# EAGLE design arduino-breakout (EAGLE 5.02)
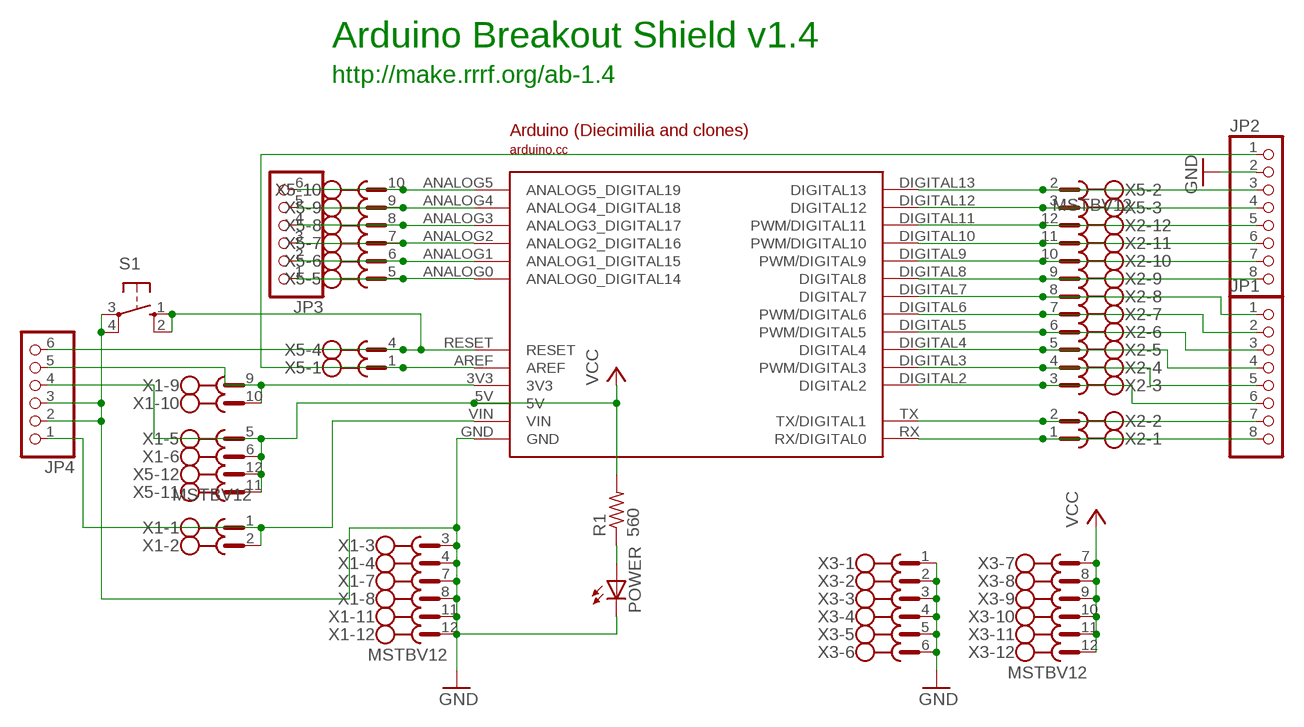
[diagram p0: schematic, sheet 1]

## Parts
JP1  PINHD-1X8  [1X08]
JP2  PINHD-1X8  [1X08]
JP3  PINHD-1X6  [1X06]
JP4  PINHD-1X6  [1X06]
POWER  LED5MM  [LED5MM]
R1  560  R-US_0207/7  [0207/7]
S1  10-XX  [B3F-10XX]
U$1  ARDUINODIECIMILIA  [ARDUINO]
X1  MSTBV12  [MSTBV12]
X2  MSTBV12  [MSTBV12]
X3  MSTBV12  [MSTBV12]
X5  MSTBV12  [MSTBV12]

## Nets
GND: JP2.2 JP4.2 JP4.3 POWER.K(C) S1.3(P) S1.4(P1) U$1.GND X1.3 X1.4 X1.7 X1.8 X1.11 X1.12 X3.1 X3.2 X3.3 X3.4 X3.5 X3.6
N$1: JP1.8 U$1.RX(RX/DIGITAL0) X2.1
N$2: JP1.7 U$1.TX(TX/DIGITAL1) X2.2
N$3: JP1.6 U$1.DIGITAL2 X2.3
N$4: JP1.5 U$1.DIGITAL3(PWM/DIGITAL3) X2.4
N$5: JP1.4 U$1.DIGITAL4 X2.5
N$6: JP1.3 U$1.DIGITAL5(PWM/DIGITAL5) X2.6
N$7: JP1.2 U$1.DIGITAL6(PWM/DIGITAL6) X2.7
N$8: JP1.1 U$1.DIGITAL7 X2.8
N$9: JP2.8 U$1.DIGITAL8 X2.9
N$10: JP2.7 U$1.DIGITAL9(PWM/DIGITAL9) X2.10
N$11: JP2.6 U$1.DIGITAL10(PWM/DIGITAL10) X2.11
N$12: JP2.5 U$1.DIGITAL11(PWM/DIGITAL11) X2.12
N$13: JP2.4 U$1.DIGITAL12 X5.3
N$14: JP2.3 U$1.DIGITAL13 X5.2
N$15: JP4.6 S1.1(S) S1.2(S1) U$1.RESET X5.4
N$16: POWER.A R1.1
N$17: JP3.6 U$1.ANALOG5(ANALOG5_DIGITAL19) X5.10
N$18: JP3.5 U$1.ANALOG4(ANALOG4_DIGITAL18) X5.9
N$19: JP3.4 U$1.ANALOG3(ANALOG3_DIGITAL17) X5.8
N$20: JP3.3 U$1.ANALOG2(ANALOG2_DIGITAL16) X5.7
N$21: JP3.2 U$1.ANALOG1(ANALOG1_DIGITAL15) X5.6
N$22: JP3.1 U$1.ANALOG0(ANALOG0_DIGITAL14) X5.5
N$23: JP2.1 U$1.AREF X5.1
N$26: JP4.5 U$1.3V3 X1.9 X1.10
N$28: JP4.1 U$1.VIN X1.1 X1.2
VCC: JP4.4 R1.2 U$1.5V X1.5 X1.6 X3.7 X3.8 X3.9 X3.10 X3.11 X3.12 X5.11 X5.12

## Notes on the sheet
- Arduino Breakout Shield v1.4
- http://make.rrrf.org/ab-1.4

## Library data of the parts
JP1 JP2 = pinhead:PINHD-1X8: PIN HEADER
JP3 JP4 = pinhead:PINHD-1X6: PIN HEADER
POWER = led:LED: LED OSRAM: - CHIPLED LG R971, LG N971, LY N971, LG Q971, LY Q971, LO R971, LY R971 LH N974, LH R974 LS Q976, LO Q976, LY Q976 LO Q996 - Hyper CHIPLED LW Q18S LB Q993, LB Q99A, LB R99A - SideLED LS A670, LO A670, LY A670, LG A670, LP A670 LB A673, LV A673, LT A673, LW A673 LH A674 LY A675 LS A676, LA A676, LO A676, LY A676, LW A676 LS A679, LY A679, LG A679 - Hyper Micro SIDELED® LS Y876, LA Y876, LO Y876, LY Y876 LT Y87S - SmartLED LW L88C, LW L88S LB L89C, LB L89S, LG L890 LS L89K, LO L89K, LY L89K LS L896, LA L896, LO L896, LY L896 - TOPLED LS T670, LO T670, LY T670, LG T670, LP T670 LSG T670, LSP T670, LSY T670, LOP T670, LYG T670 LG T671, LOG T671, LSG T671 LB T673, LV T673, LT T673, LW T673 LH T674 LS T676, LA T676, LO T676, LY T676, LB T676, LH T676, LSB T676, LW T676 LB T67C, LV T67C, LT T67C, LS T67K, LO T67K, LY T67K, LW E67C LS E67B, LA E67B, LO E67B, LY E67B, LB E67C, LV E67C, LT E67C LW T67C LS T679, LY T679, LG T679 LS T770, LO T770, LY T770, LG T770, LP T770 LB T773, LV T773, LT T773, LW T773 LH T774 LS E675, LA E675, LY E675, LS T675 LS T776, LA T776, LO T776, LY T776, LB T776 LHGB T686 LT T68C, LB T68C - Hyper Mini TOPLED® LB M676 - Mini TOPLED Santana® LG M470 LS M47K, LO M47K, LY M47K Source: http://www.osram.convergy.de - LUMILED® LXK2-PW12-R00, LXK2-PW12-S00, LXK2-PW14-U00, LXK2-PW14-V00 LXK2-PM12-R00, LXK2-PM12-S00, LXK2-PM14-U00 LXK2-PE12-Q00, LXK2-PE12-R00, LXK2-PE12-S00, LXK2-PE14-T00, LXK2-PE14-U00 LXK2-PB12-K00, LXK2-PB12-L00, LXK2-PB12-M00, LXK2-PB14-N00, LXK2-PB14-P00, LXK2-PB14-Q00 LXK2-PR12-L00, LXK2-PR12-M00, LXK2-PR14-Q00, LXK2-PR14-R00 LXK2-PD12-Q00, LXK2-PD12-R00, LXK2-PD12-S00 LXK2-PH12-R00, LXK2-PH12-S00 LXK2-PL12-P00, LXK2-PL12-Q00, LXK2-PL12-R00 Source: www.luxeon.com
R1 = rcl:R-US_: RESISTOR, American symbol
S1 = switch-omron:10-XX: OMRON SWITCH
U$1 = reprap:ARDUINO
X1-X3 X5 = con-phoenix-508:MSTBV12: PHOENIX

## Net classes
0 default: width 0.813 mm, clearance 0.406 mm

## Board
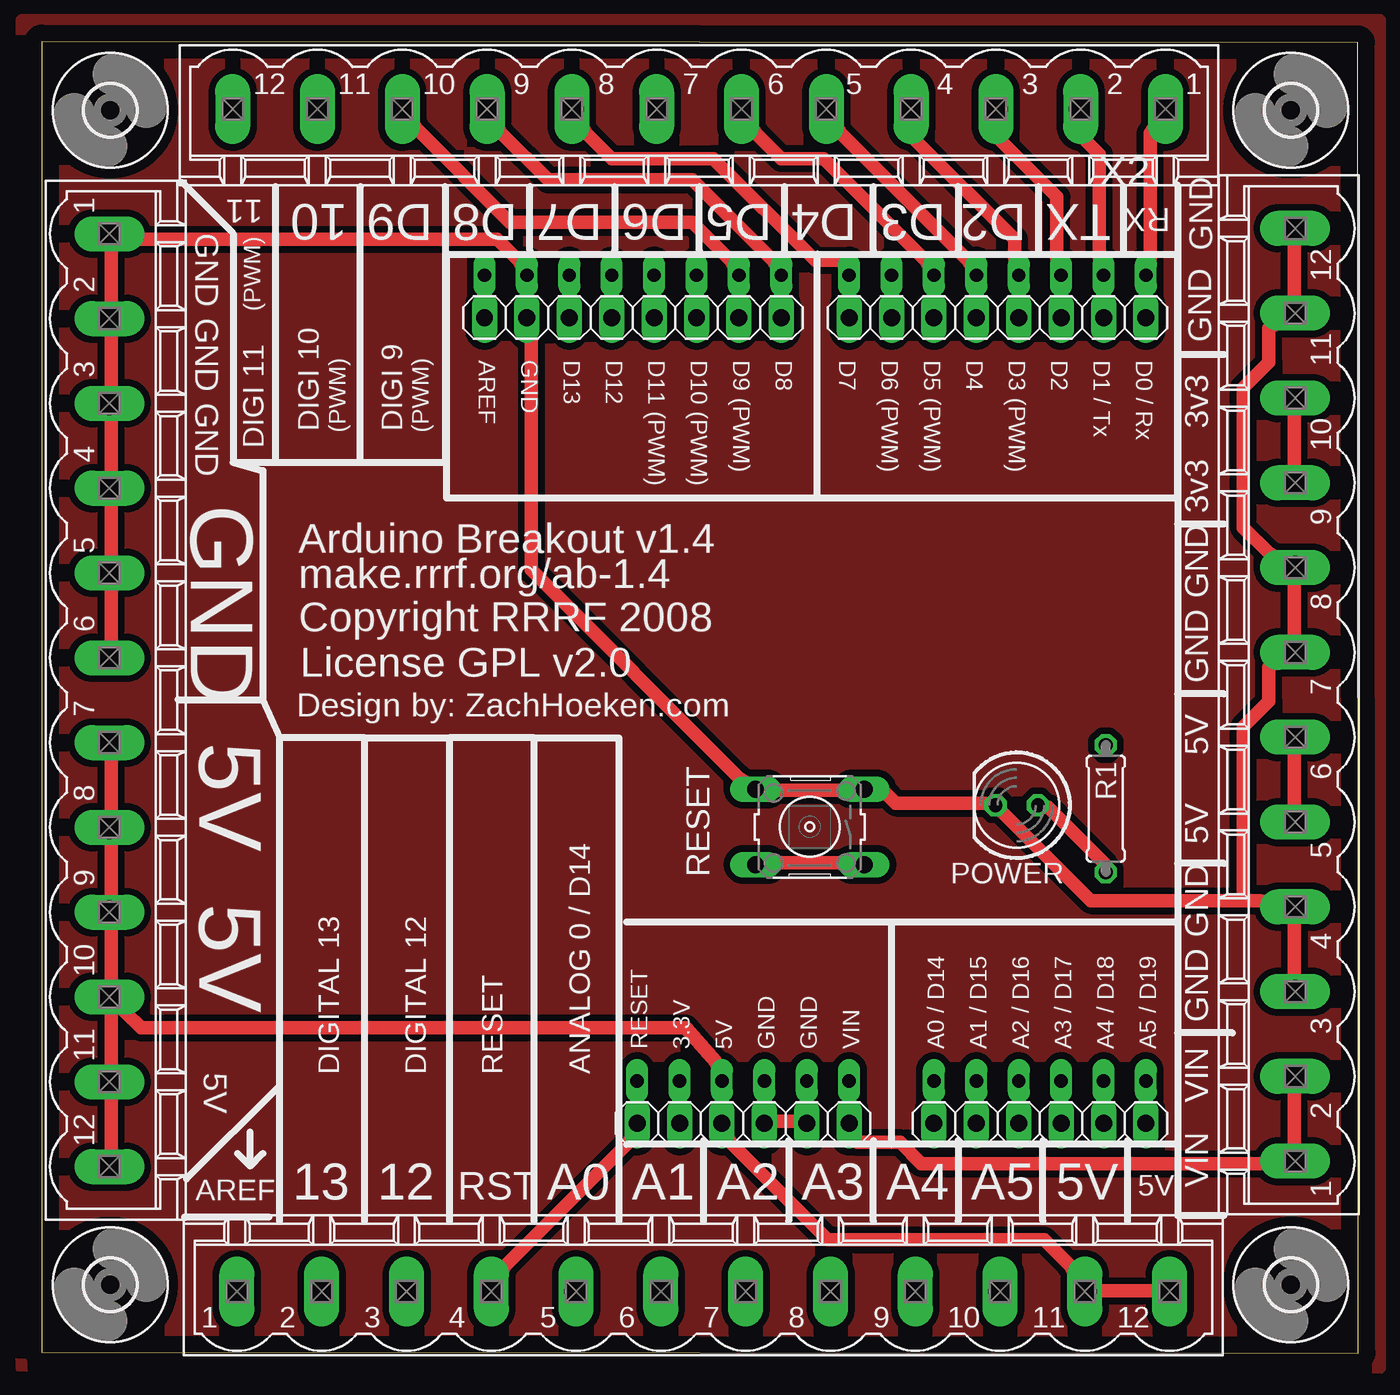
[diagram p1: board, top side]
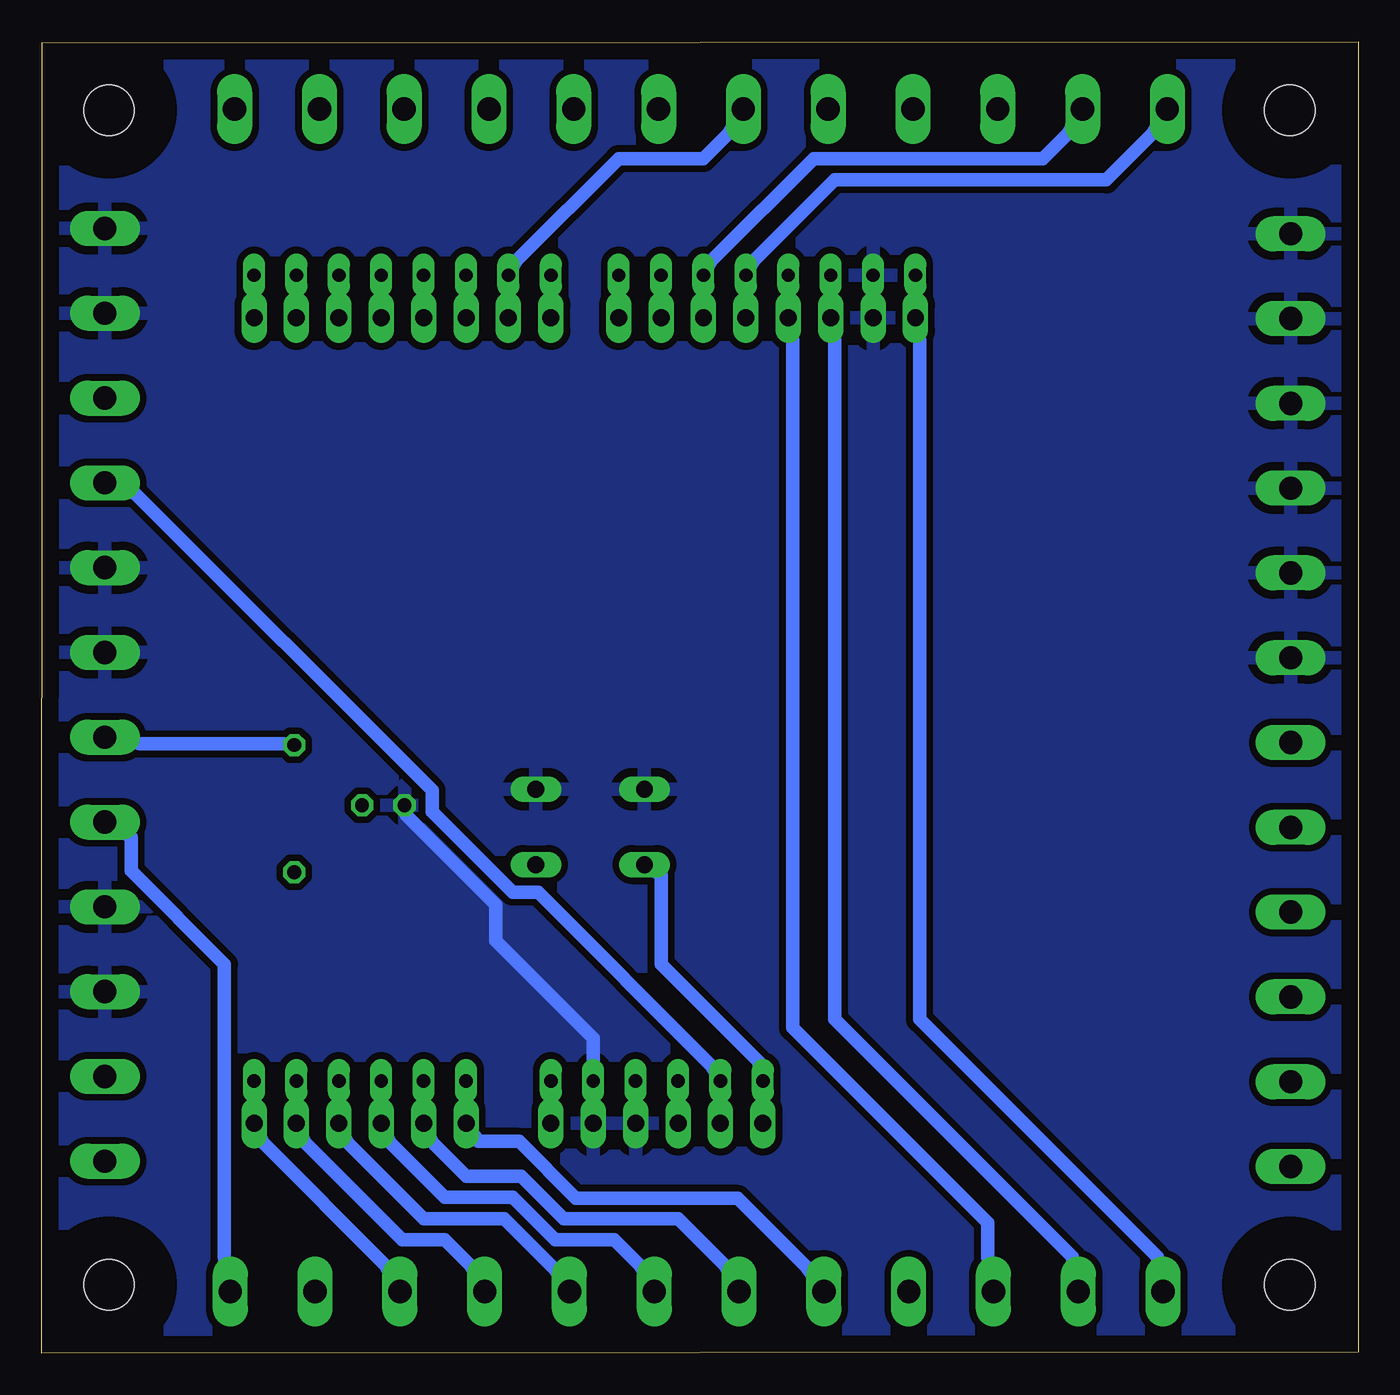
[diagram p2: board, bottom side, seen from below]

Size 78.87 x 78.55 mm. Coordinates in mm from the lower left corner, seen from the top.
Outline: 0,0.05 78.87,0 78.84,78.5 0,78.55 0,0.05
Copper layers (1*16): Top 0.035mm / dielectric 1.5mm / Bottom 0.035mm
Design rules "default": minimum track width 10mil, minimum drill 24mil, track to track 8mil, track to pad 8mil, pad to pad 8mil, via to via 8mil, smd to smd 8mil, copper to edge 40mil, drill to drill 8mil, minimum pad ring 10mil, minimum via ring 8mil, stop-mask expansion 4mil, vias tented up to drill 0mil, thermal gap 20mil

### Footprints (pad centres in the part's own frame; a part is rotated, then mirrored left to right if it is on the bottom)
1X08 = drill 1.016 long: 1 -8.89,0; 2 -6.35,0; 3 -3.81,0; 4 -1.27,0; 5 1.27,0; 6 3.81,0; 7 6.35,0; 8 8.89,0
1X06 = drill 1.016 long: 1 -6.35,0; 2 -3.81,0; 3 -1.27,0; 4 1.27,0; 5 3.81,0; 6 6.35,0
LED5MM = drill 0.813 octagon: A -1.27,0; K 1.27,0
0207/7 = drill 0.813 octagon: 1 -3.81,0; 2 3.81,0
B3F-10XX = drill 1.016 long: 1 -3.251,2.261; 2 3.251,2.261; 3 -3.251,-2.261; 4 3.251,-2.261
ARDUINO = drill 0.8 long: 3V3 6.604,-45.72; 5V 9.144,-45.72; ANALOG0 21.844,-45.72; ANALOG1 24.384,-45.72; ANALOG2 26.924,-45.72; ANALOG3 29.464,-45.72; ANALOG4 32.004,-45.72; ANALOG5 34.544,-45.72; AREF -5.08,2.54; DIGITAL2 29.464,2.54; DIGITAL3 26.924,2.54; DIGITAL4 24.384,2.54; DIGITAL5 21.844,2.54; DIGITAL6 19.304,2.54; DIGITAL7 16.764,2.54; DIGITAL8 12.7,2.54; DIGITAL9 10.16,2.54; DIGITAL10 7.62,2.54; DIGITAL11 5.08,2.54; DIGITAL12 2.54,2.54; DIGITAL13 0,2.54; GND -2.54,2.54; GND1 14.224,-45.72; GND2 11.684,-45.72; RESET 4.064,-45.72; RX 34.544,2.54; TX 32.004,2.54; VIN 16.764,-45.72
3,0 = hole 3: 0,0
MSTBV12 = drill 1.397 long: 1 -27.94,0; 2 -22.86,0; 3 -17.78,0; 4 -12.7,0; 5 -7.62,0; 6 -2.54,0; 7 2.54,0; 8 7.62,0; 9 12.7,0; 10 17.78,0; 11 22.86,0; 12 27.94,0

### Placement (x,y rotation side)
JP1  57.26,62.02 0 top
JP2  35.42,62.02 0 top
JP3  59.8,13.76 0 top
JP4  42.02,13.76 180 top
POWER  58.41,32.81 180 top
R1  63.74,32.61 90 top
S1  46.01,31.52 180 top
U$1  31.61,62.02 0 top
U$2  [3,0]  4.1,74.44 0 top
U$3  [3,0]  4.1,4.09 0 top
U$4  [3,0]  74.84,4.09 0 top
U$5  [3,0]  74.84,74.44 0 top
X1  75.09,39.43 90 top
X2  39.38,74.52 180 top
X3  4.05,39.11 270 top
X5  39.63,3.68 0 top

### Tracks (layer width: path | path; a pad name or v marks a point on that pad's centre or on a via)
GND
  Top 0.813: X3.6 4.17,42.59 4.17,45.89 X3.5 4.17,47.67 4.17,50.97 X3.4 4.17,52.75 4.17,56.05 X3.3 4.17,57.83 4.17,61.13 X3.2 4.17,62.91 4.17,66.21 X3.1 5.95,66.72 27.29,66.72 28.56,65.45 U$1.GND JP2.2 29.32,60.63 29.32,46.91 41.77,34.46 S1.4 44.05,33.7 47.86,33.7 S1.3 50.66,33.45 51.16,32.94 56.5,32.94 POWER.K 57.51,32.43 62.85,27.1 71.99,27.1 | X1.12 75.04,66.47 75.04,63.17 X1.11 73.52,61.39 73.52,59.36 71.99,57.83 71.99,49.45 73.52,47.93 X1.8 75.04,46.15 75.04,42.85 X1.7 73.52,41.07 73.52,39.04 71.99,37.51 71.99,27.1 | X1.3 75.04,22.53 75.04,25.83 X1.4 73.01,27.1 71.99,27.1 | JP4.3 43.8,13.89 45.32,13.89 JP4.2
  Bottom 0.813: POWER.K 57.01,32.18 51.67,26.84 51.67,24.69 45.83,18.84 JP4.2
  pour Bottom: -1.16,79.8 80.12,79.8 80.12,-0.84 -1.16,-0.84
N$1
  Top 0.813: JP1.8 U$1.RX 66.4,65.71 66.4,73.07 X2.1
N$2
  Top 0.813: JP1.7 U$1.TX 63.36,65.71 63.36,71.8 62.59,72.56 X2.2
N$3
  Top 0.813: JP1.6 U$1.DIGITAL2 60.82,65.71 60.82,69.26 57.51,72.56 X2.3
N$4
  Top 0.813: JP1.5 U$1.DIGITAL3 58.28,65.71 58.28,66.72 52.43,72.56 X2.4
N$5
  Top 0.813: JP1.4 U$1.DIGITAL4 55.48,65.45 47.86,73.07 X2.5
N$6
  Top 0.813: JP1.3 U$1.DIGITAL5 52.94,65.45 46.85,71.55 44.31,71.55 42.78,73.07 X2.6
N$7
  Top 0.813: U$1.DIGITAL6 JP1.2
  Bottom 0.813: U$1.DIGITAL6 50.4,65.45 44.31,71.55 39.23,71.55 37.7,73.07 X2.7
N$8
  Top 0.813: JP1.1 U$1.DIGITAL7 47.86,65.45 46.34,65.45 40.24,71.55 34.15,71.55 32.62,73.07 X2.8
N$9
  Top 0.813: JP2.8 U$1.DIGITAL8 43.8,65.45 38.97,70.28 30.34,70.28 27.54,73.07 X2.9
N$10
  Top 0.813: JP2.7 U$1.DIGITAL9 41.26,65.45 38.97,67.74 28.05,67.74 22.46,73.33 X2.10
N$11
  Top 0.813: U$1.DIGITAL10 JP2.6
  Bottom 0.813: U$1.DIGITAL10 38.72,65.45 32.62,71.55 18.91,71.55 17.38,73.07 X2.11
N$12
  Top 0.813: U$1.DIGITAL11 JP2.5
  Bottom 0.813: U$1.DIGITAL11 36.18,65.45 31.35,70.28 15.1,70.28 12.3,73.07 X2.12
N$13
  Top 0.813: JP2.4 U$1.DIGITAL12
  Bottom 0.813: JP2.4 33.89,60.63 33.89,19.48 22.21,7.79 22.21,5.76 X5.3
N$14
  Top 0.813: JP2.3 U$1.DIGITAL13
  Bottom 0.813: JP2.3 31.35,60.63 31.35,19.99 17.13,5.76 X5.2
N$15
  Top 0.813: S1.2 44.05,29.38 47.86,29.38 S1.1 | U$1.RESET JP4.6 35.16,12.62 27.8,5.25 X5.4
  Bottom 0.813: S1.2 41.77,28.62 41.77,23.29 35.92,17.45 U$1.RESET
N$16
  Top 0.813: POWER.A 60.31,32.69 63.61,29.38 R1.1
N$17
  Top 0.813: JP3.6 U$1.ANALOG5
  Bottom 0.813: JP3.6 65.64,12.62 58.28,5.25 X5.10
N$18
  Top 0.813: JP3.5 U$1.ANALOG4
  Bottom 0.813: JP3.5 63.1,12.62 57.26,6.78 54.72,6.78 53.2,5.25 X5.9
N$19
  Top 0.813: JP3.4 U$1.ANALOG3
  Bottom 0.813: JP3.4 60.56,12.62 55.99,8.05 51.16,8.05 48.12,5 X5.8
N$20
  Top 0.813: JP3.3 U$1.ANALOG2
  Bottom 0.813: JP3.3 58.02,12.62 54.72,9.32 50.66,9.32 48.12,6.78 44.56,6.78 43.04,5.25 X5.7
N$21
  Top 0.813: JP3.2 U$1.ANALOG1
  Bottom 0.813: JP3.2 55.48,12.62 53.45,10.59 50.15,10.59 47.61,8.05 40.75,8.05 37.96,5.25 X5.6
N$22
  Top 0.813: JP3.1 U$1.ANALOG0
  Bottom 0.813: JP3.1 52.71,12.67 50.27,12.67 46.87,9.27 37.17,9.27 33.05,5.15 X5.5
N$23
  Top 0.813: JP2.1 U$1.AREF
  Bottom 0.813: JP2.1 26.27,60.63 26.27,19.99 12.05,5.76 X5.1
N$24
  pour Top: -1.16,79.8 80.12,79.8 80.12,-0.84 -1.16,-0.84
N$26
  Top 0.813: JP4.5 U$1.3V3 | X1.10 75.04,56.31 75.04,53.01 X1.9
  Bottom 0.813: U$1.3V3 38.72,17.19 49.13,27.61 50.66,27.61 55.48,32.43 55.48,33.7 73.26,51.48 X1.9
N$28
  Top 0.813: U$1.VIN JP4.1 48.88,12.62 51.42,12.62 52.69,11.35 73.01,11.35 X1.1 75.04,12.37 75.04,15.67 X1.2
VCC
  Top 0.813: X3.7 4.17,35.73 4.17,32.43 X3.8 4.17,30.65 4.17,27.35 X3.9 4.17,25.57 4.17,22.27 X3.10 | X3.12 4.17,12.11 4.17,15.41 X3.11 4.17,17.19 4.17,20.49 X3.10 | X1.5 75.04,32.69 75.04,35.99 X1.6 | X5.12 66.66,3.73 63.36,3.73 X5.11 61.58,5.25 60.05,6.78 47.1,6.78 41.26,12.62 JP4.4 U$1.5V 40.37,17.45 38.59,19.48 5.95,19.48 X3.10
  Bottom 0.813: R1.2 64.37,36.5 73.01,36.5 X1.6 | X1.5 73.52,30.91 73.52,28.88 67.93,23.29 67.93,5.76 X5.12

### Text on the board
tPlace: 11 | 10 | D9 | D8 | D7 | D6 | D5 | D4 | D3 | D2 | TX | RX | GND | GND | (PWM) | GND | GND | AREF | GND | D13 | D12 | D11 (PWM) | D10 (PWM) | D9 (PWM) | D8 | D7 | D6 (PWM) | D5 (PWM) | D4 | D3 (PWM) | D2 | D1 / Tx | D0 / Rx | GND | DIGI 10 | (PWM) | DIGI 9 | (PWM) | 3v3 | DIGI 11 | GND | 3v3 | Arduino Breakout v1.4 | make.rrrf.org/ab-1.4 | GND | Copyright RRRF 2008 | License GPL v2.0 | GND | Design by: ZachHoeken.com | 5V | 5V | 5V | RESET | 5V | GND | GND | RESET | 3.3V | 5V | GND | GND | VIN | A0 / D14 | A1 / D15 | A2 / D16 | A3 / D17 | A4 / D18 | A5 / D19 | 5V | DIGITAL 13 | DIGITAL 12 | RESET | ANALOG 0 / D14 | VIN | 5V | AREF | 13 | 12 | RST | A0 | A1 | A2 | A3 | A4 | A5 | 5V | VIN